# EAGLE design RPi_Extension_dac (EAGLE 8.4.3)
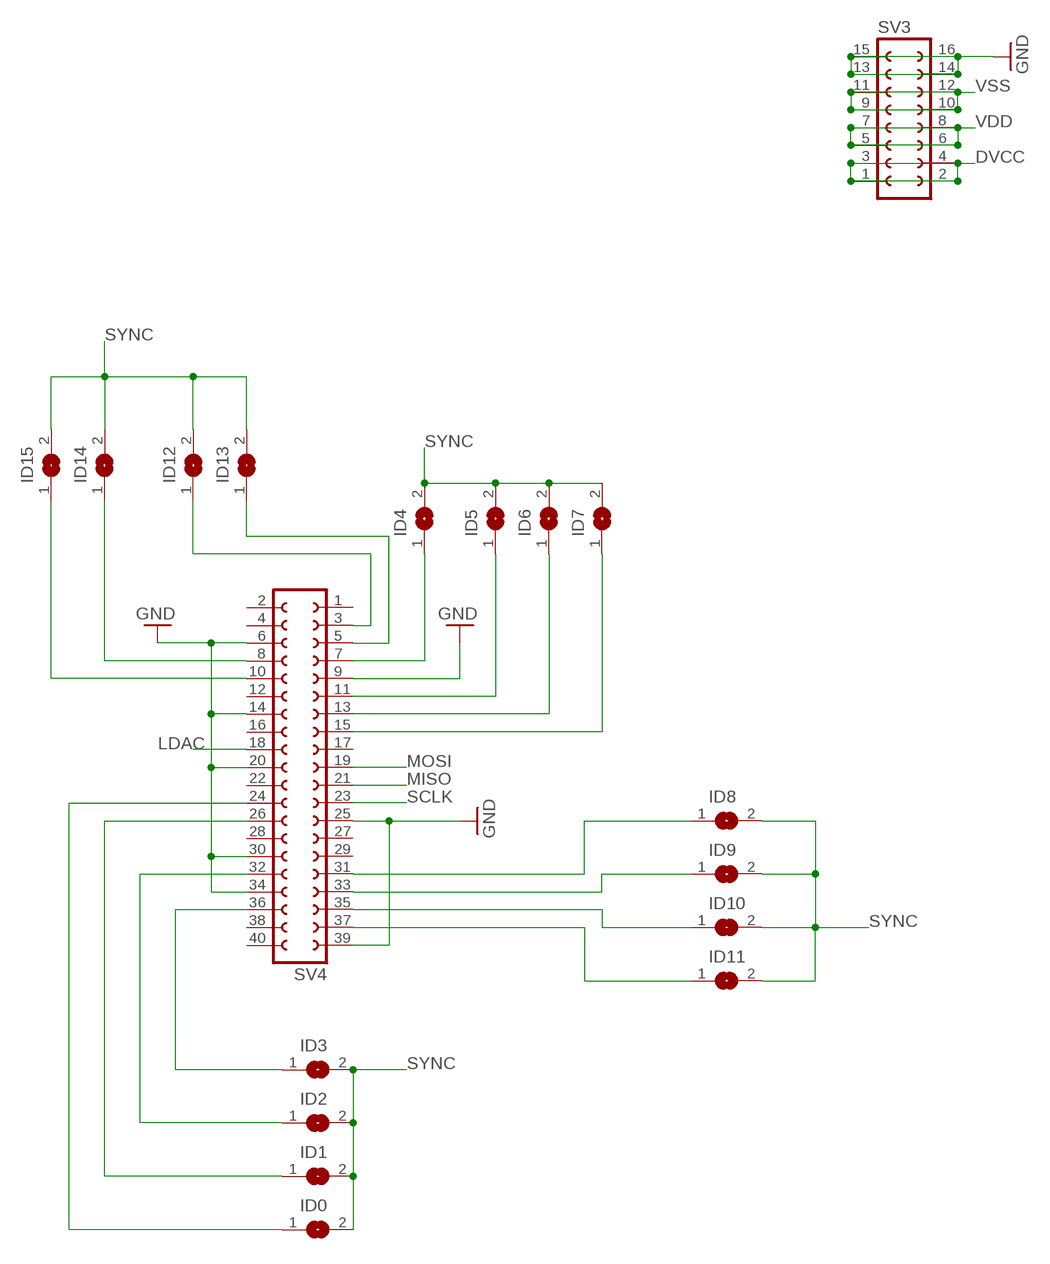
[diagram p0: schematic, sheet 1, part 1 of 2]
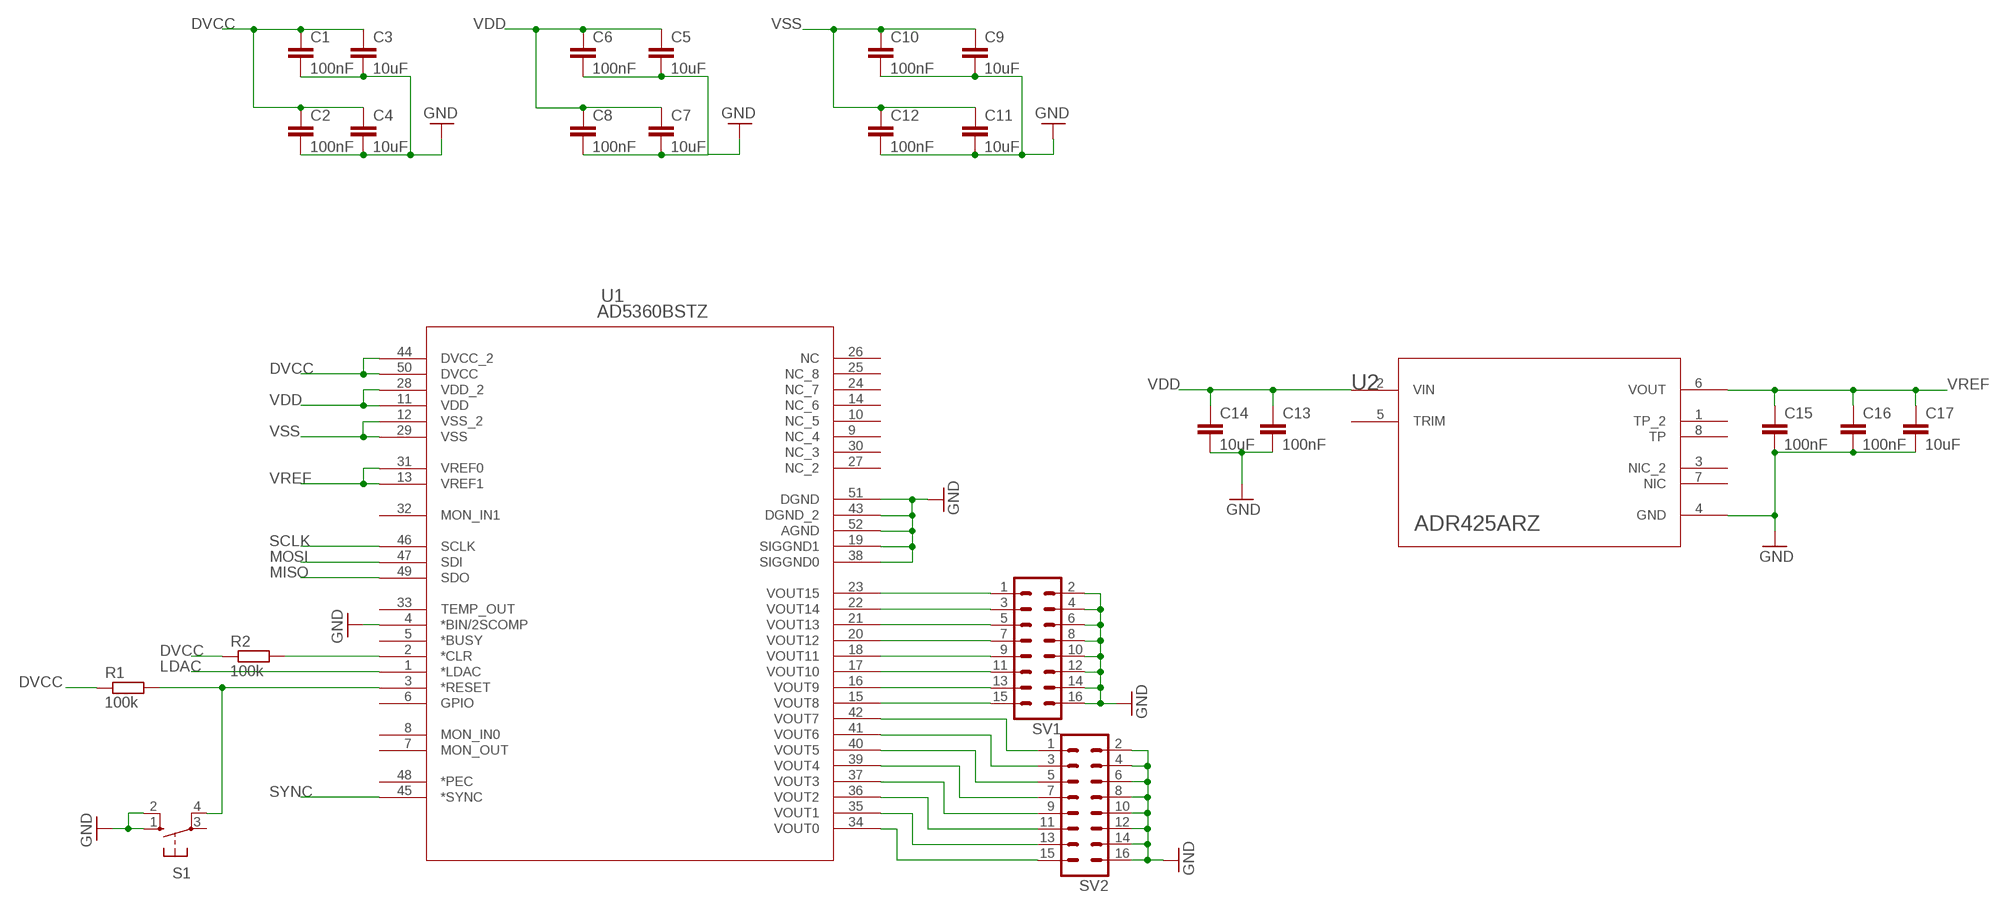
[diagram p1: schematic, sheet 1, part 2 of 2]

## Parts
C1  100nF  C-EUC0603  [C0603]
C2  100nF  C-EUC0603  [C0603]
C3  10uF  C-EUC1206  [C1206]
C4  10uF  C-EUC1206  [C1206]
C5  10uF  C-EUC1206  [C1206]
C6  100nF  C-EUC0603  [C0603]
C7  10uF  C-EUC1206  [C1206]
C8  100nF  C-EUC0603  [C0603]
C9  10uF  C-EUC1206  [C1206]
C10  100nF  C-EUC0603  [C0603]
C11  10uF  C-EUC1206  [C1206]
C12  100nF  C-EUC0603  [C0603]
C13  100nF  C-EUC0603  [C0603]
C14  10uF  C-EUC1206  [C1206]
C15  100nF  C-EUC0603  [C0603]
C16  100nF  C-EUC0603  [C0603]
C17  10uF  C-EUC1206  [C1206]
ID0  SJ  [SJ]
ID1  SJ  [SJ]
ID2  SJ  [SJ]
ID3  SJ  [SJ]
ID4  SJ  [SJ]
ID5  SJ  [SJ]
ID6  SJ  [SJ]
ID7  SJ  [SJ]
ID8  SJ  [SJ]
ID9  SJ  [SJ]
ID10  SJ  [SJ]
ID11  SJ  [SJ]
ID12  SJ  [SJ]
ID13  SJ  [SJ]
ID14  SJ  [SJ]
ID15  SJ  [SJ]
R1  100k  R-EU_R0603  [R0603]
R2  100k  R-EU_R0603  [R0603]
S1  10-XX  [B3F-10XX]
SV1  MA08-2W  [MA08-2W]
SV2  MA08-2W  [MA08-2W]
SV3  FE08-2  [FE08-2]
SV4  FE20-2  [FE20-2]
U1  AD5360BSTZ  [ST_52]
U2  ADR425ARZ  ADR423ARZ  [R_8]

## Nets
DVCC: C1.1 C2.1 C3.1 C4.1 R1.1 R2.1 SV3.1 SV3.2 SV3.3 SV3.4 U1.44(DVCC_2) U1.50(DVCC)
GND: C1.2 C2.2 C3.2 C4.2 C5.2 C6.2 C7.2 C8.2 C9.2 C10.2 C11.2 C12.2 C13.2 C14.2 C15.2 C16.2 C17.2 S1.1(S) S1.2(S1) SV1.2 SV1.4 SV1.6 SV1.8 SV1.10 SV1.12 SV1.14 SV1.16 SV2.2 SV2.4 SV2.6 SV2.8 SV2.10 SV2.12 SV2.14 SV2.16 SV3.13 SV3.14 SV3.15 SV3.16 SV4.6 SV4.9 SV4.14 SV4.20 SV4.25 SV4.30 SV4.34 SV4.39 U1.4(*BIN/2SCOMP) U1.19(SIGGND1) U1.38(SIGGND0) U1.43(DGND_2) U1.51(DGND) U1.52(AGND) U2.4(GND)
LDAC: SV4.18 U1.1(*LDAC)
MISO: SV4.21 U1.49(SDO)
MOSI: SV4.19 U1.47(SDI)
N$1: R2.2 U1.2(*CLR)
N$2: SV1.1 U1.23(VOUT15)
N$3: SV1.3 U1.22(VOUT14)
N$4: SV1.5 U1.21(VOUT13)
N$5: SV1.7 U1.20(VOUT12)
N$6: SV1.9 U1.18(VOUT11)
N$7: SV1.11 U1.17(VOUT10)
N$8: SV1.13 U1.16(VOUT9)
N$9: SV1.15 U1.15(VOUT8)
N$10: SV2.1 U1.42(VOUT7)
N$11: SV2.3 U1.41(VOUT6)
N$12: SV2.5 U1.40(VOUT5)
N$13: SV2.7 U1.39(VOUT4)
N$14: SV2.9 U1.37(VOUT3)
N$15: SV2.11 U1.36(VOUT2)
N$16: SV2.13 U1.35(VOUT1)
N$17: SV2.15 U1.34(VOUT0)
N$18: R1.2 S1.4(P1) U1.3(*RESET)
N$19: ID8.1 SV4.31
N$20: ID3.1 SV4.36
N$21: ID4.1 SV4.7
N$22: ID2.1 SV4.32
N$23: ID1.1 SV4.26
N$24: ID0.1 SV4.24
N$25: ID5.1 SV4.11
N$26: ID6.1 SV4.13
N$27: ID7.1 SV4.15
N$28: ID9.1 SV4.33
N$29: ID10.1 SV4.35
N$30: ID11.1 SV4.37
N$31: ID12.1 SV4.3
N$32: ID13.1 SV4.5
N$33: ID14.1 SV4.8
N$34: ID15.1 SV4.10
SCLK: SV4.23 U1.46(SCLK)
SYNC: ID0.2 ID1.2 ID2.2 ID3.2 ID4.2 ID5.2 ID6.2 ID7.2 ID8.2 ID9.2 ID10.2 ID11.2 ID12.2 ID13.2 ID14.2 ID15.2 U1.45(*SYNC)
VDD: C5.1 C6.1 C7.1 C8.1 C13.1 C14.1 SV3.5 SV3.6 SV3.7 SV3.8 U1.11(VDD) U1.28(VDD_2) U2.2(VIN)
VREF: C15.1 C16.1 C17.1 U1.13(VREF1) U1.31(VREF0) U2.6(VOUT)
VSS: C9.1 C10.1 C11.1 C12.1 SV3.9 SV3.10 SV3.11 SV3.12 U1.12(VSS_2) U1.29(VSS)
Unconnected: S1.3(P) SV4.1 SV4.2 SV4.4 SV4.12 SV4.16 SV4.17 SV4.22 SV4.27 SV4.28 SV4.29 SV4.38 SV4.40 U1.5(*BUSY) U1.6(GPIO) U1.7(MON_OUT) U1.8(MON_IN0) U1.9(NC_4) U1.10(NC_5) U1.14(NC_6) U1.24(NC_7) U1.25(NC_8) U1.26(NC) U1.27(NC_2) U1.30(NC_3) U1.32(MON_IN1) U1.33(TEMP_OUT) U1.48(*PEC) U2.1(TP_2) U2.3(NIC_2) U2.5(TRIM) U2.7(NIC) U2.8(TP)

## Library data of the parts
C1-C17 = rcl:C-EU: CAPACITOR, European symbol
ID0 ID1-ID15 = jumper:SJ: SMD solder JUMPER
R1 R2 = resistor:R-EU_: RESISTOR, European symbol
S1 = switch-omron:10-XX: OMRON SWITCH; MPN: B3F-1000; OC_FARNELL: 176432; OC_NEWARK: 36M3542
SV1 SV2 = con-lstb:MA08-2W: PIN HEADER; OC_FARNELL: unknown; OC_NEWARK: unknown
SV3 = con-lsta:FE08-2: FEMALE HEADER; OC_FARNELL: unknown; OC_NEWARK: unknown
SV4 = con-lsta:FE20-2: FEMALE HEADER; OC_FARNELL: unknown; OC_NEWARK: unknown
U1 = AD5360BSTZ:AD5360BSTZ
U2 = ADR423ARZ:ADR423ARZ; MANUFACTURER_PART_NUMBER: ADR423ARZ; VENDOR: Vendor

## Board
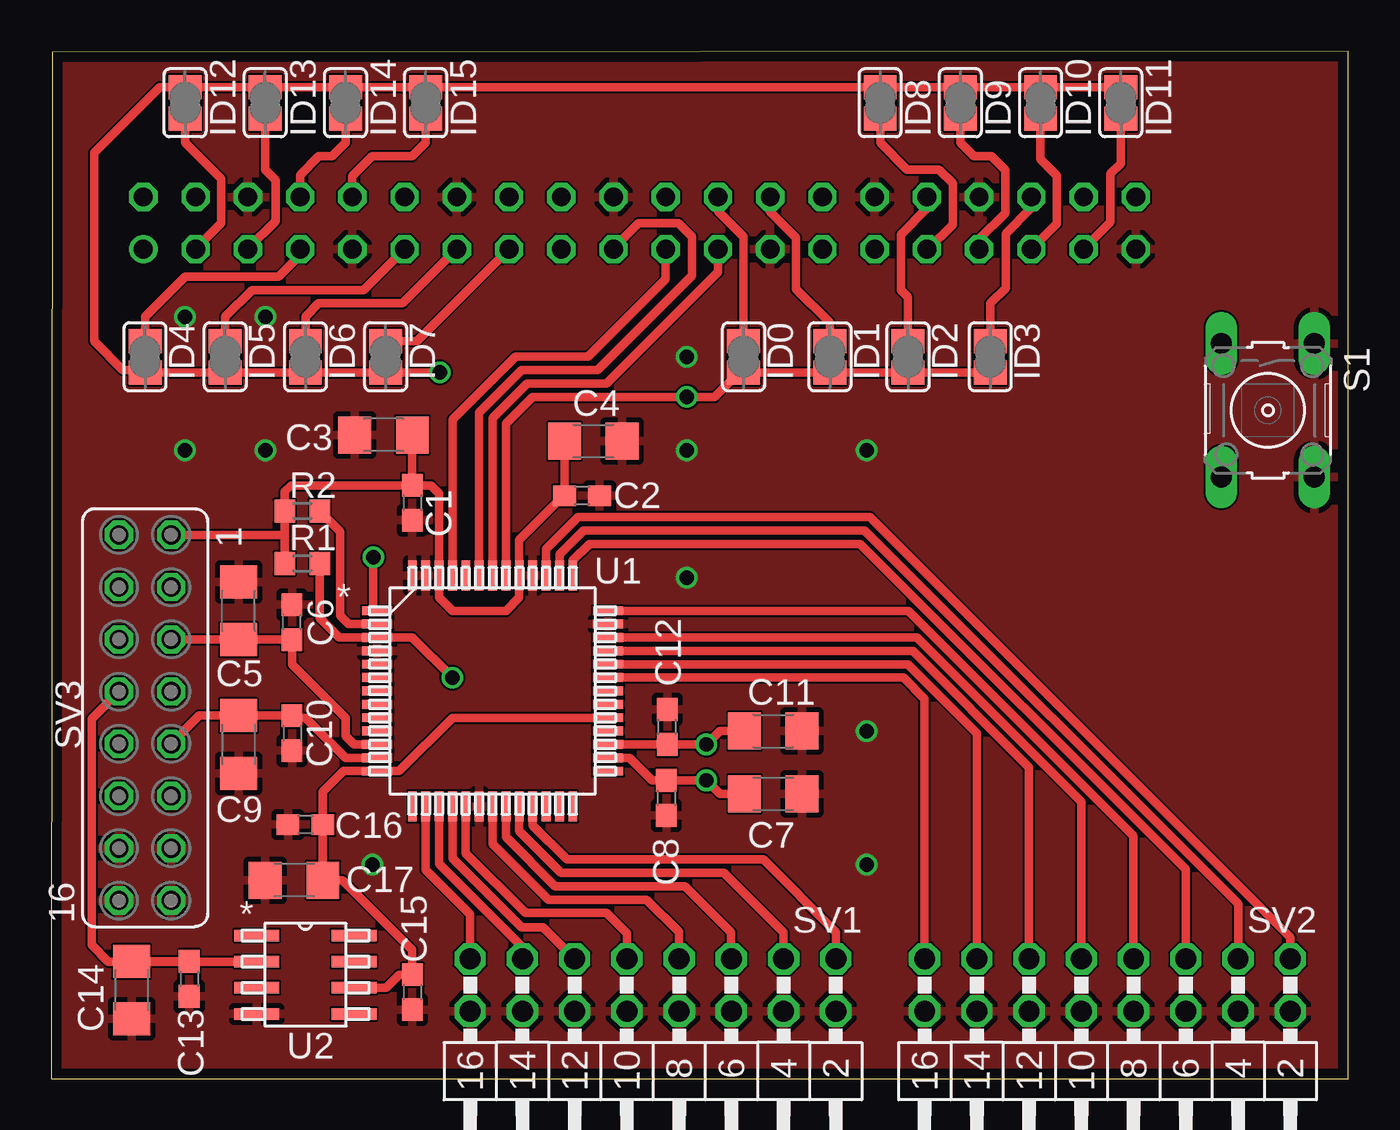
[diagram p2: board, top side]
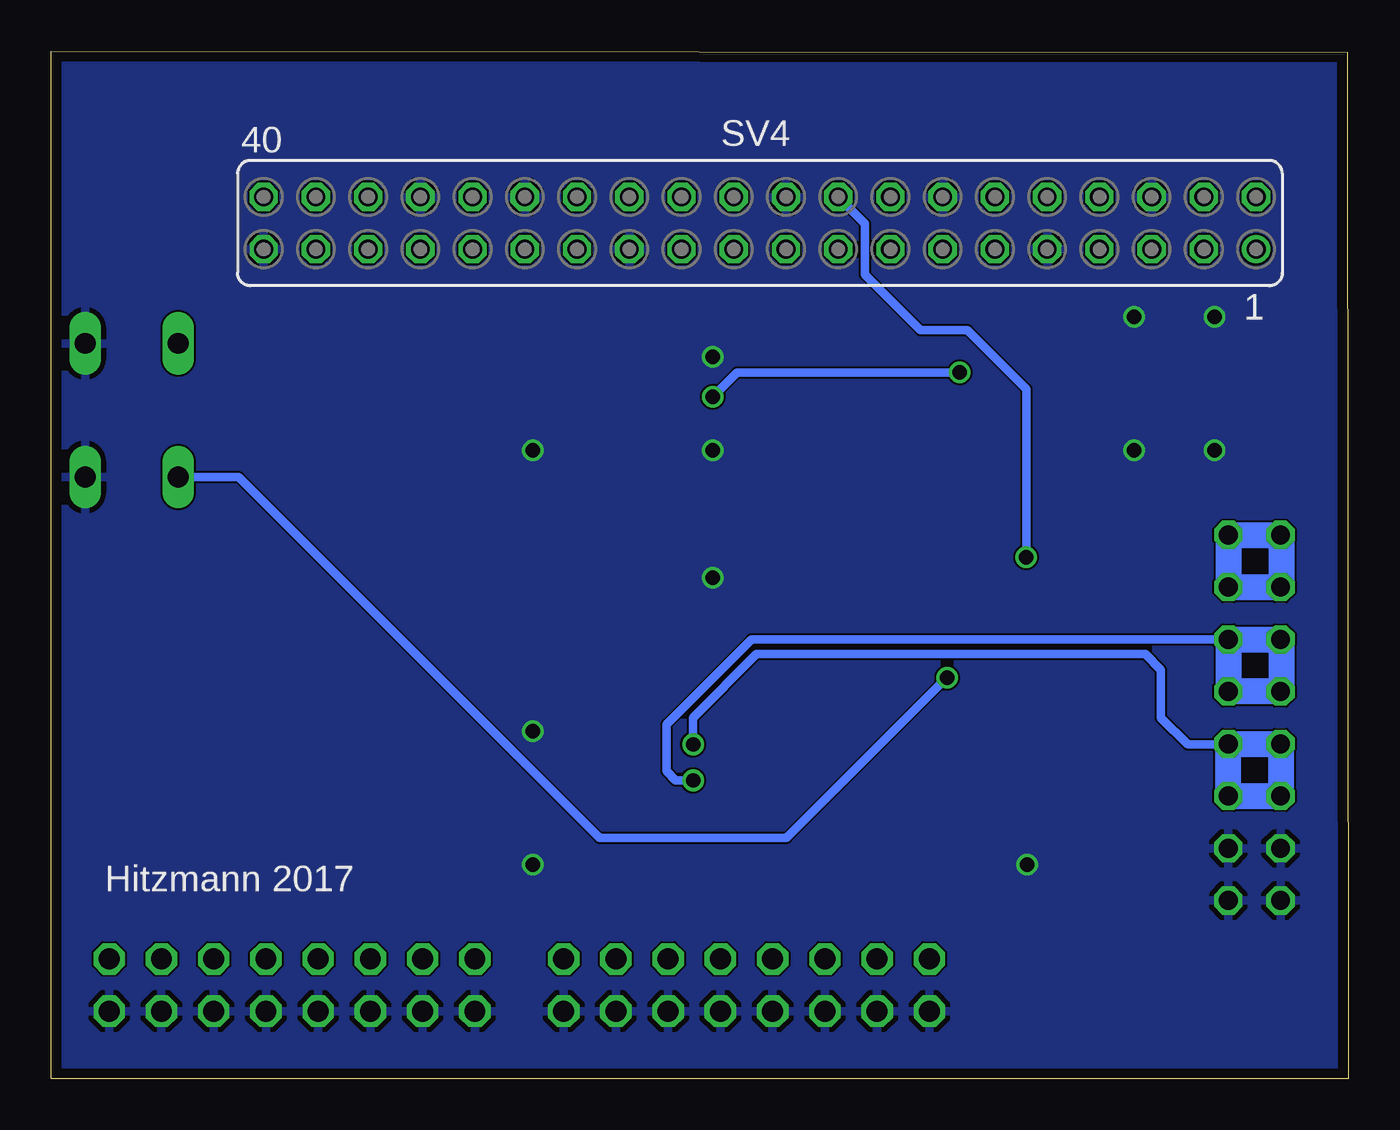
[diagram p3: board, bottom side, seen from below]

Size 63.05 x 49.95 mm. Coordinates in mm from the lower left corner, seen from the top.
Outline: 0,0 63.05,0 63.05,49.95 0.05,49.9 0,0
Copper layers (1*16): Top 0.035mm / dielectric 1.53mm / Bottom 0.035mm
Design rules "pban_4mil-l2": minimum track width 0.1mm, minimum drill 0.3mm, track to track 0.1mm, track to pad 0.229mm, pad to pad 0.1mm, via to via 0.1mm, smd to smd 0.1mm, copper to edge 0.5mm, drill to drill 0.5mm, minimum pad ring 0.15mm, minimum via ring 0.15mm, stop-mask expansion 4mil, vias tented up to drill 0.35mm, thermal gap 10mil

### Footprints (pad centres in the part's own frame; a part is rotated, then mirrored left to right if it is on the bottom)
C0603 = smd 1.1 x 1: 1 -0.85,0; 2 0.85,0
C1206 = smd 1.6 x 1.8: 1 -1.4,0; 2 1.4,0
SJ = smd 1.168 x 1.6: 1 -0.762,0; 2 0.762,0
R0603 = smd 1 x 1.1: 1 -0.85,0; 2 0.85,0
B3F-10XX = drill 1.016 long: 1 -3.251,2.261; 2 3.251,2.261; 3 -3.251,-2.261; 4 3.251,-2.261
MA08-2W = drill 1.016 octagon: 1 -8.89,-1.27; 2 -8.89,1.27; 3 -6.35,-1.27; 4 -6.35,1.27; 5 -3.81,-1.27; 6 -3.81,1.27; 7 -1.27,-1.27; 8 -1.27,1.27; 9 1.27,-1.27; 10 1.27,1.27; 11 3.81,-1.27; 12 3.81,1.27; 13 6.35,-1.27; 14 6.35,1.27; 15 8.89,-1.27; 16 8.89,1.27
FE08-2 = drill 0.914 octagon: 1 -8.89,1.27; 2 -8.89,-1.27; 3 -6.35,1.27; 4 -6.35,-1.27; 5 -3.81,1.27; 6 -3.81,-1.27; 7 -1.27,1.27; 8 -1.27,-1.27; 9 1.27,1.27; 10 1.27,-1.27; 11 3.81,1.27; 12 3.81,-1.27; 13 6.35,1.27; 14 6.35,-1.27; 15 8.89,1.27; 16 8.89,-1.27
FE20-2 = drill 0.914: 1 -24.13,1.27 | drill 0.914 octagon: 2 -24.13,-1.27; 3 -21.59,1.27; 4 -21.59,-1.27; 5 -19.05,1.27; 6 -19.05,-1.27; 7 -16.51,1.27; 8 -16.51,-1.27; 9 -13.97,1.27; 10 -13.97,-1.27; 11 -11.43,1.27; 12 -11.43,-1.27; 13 -8.89,1.27; 14 -8.89,-1.27; 15 -6.35,1.27; 16 -6.35,-1.27; 17 -3.81,1.27; 18 -3.81,-1.27; 19 -1.27,1.27; 20 -1.27,-1.27; 21 1.27,1.27; 22 1.27,-1.27; 23 3.81,1.27; 24 3.81,-1.27; 25 6.35,1.27; 26 6.35,-1.27; 27 8.89,1.27; 28 8.89,-1.27; 29 11.43,1.27; 30 11.43,-1.27; 31 13.97,1.27; 32 13.97,-1.27; 33 16.51,1.27; 34 16.51,-1.27; 35 19.05,1.27; 36 19.05,-1.27; 37 21.59,1.27; 38 21.59,-1.27; 39 24.13,1.27; 40 24.13,-1.27
ST_52 = smd 1.473 x 0.432: 1 -5.613,3.9; 2 -5.613,3.25; 3 -5.613,2.6; 4 -5.613,1.95; 5 -5.613,1.3; 6 -5.613,0.65; 7 -5.613,0; 8 -5.613,-0.65; 9 -5.613,-1.3; 10 -5.613,-1.95; 11 -5.613,-2.6; 12 -5.613,-3.25; 13 -5.613,-3.9; 27 5.613,-3.9; 28 5.613,-3.25; 29 5.613,-2.6; 30 5.613,-1.95; 31 5.613,-1.3; 32 5.613,-0.65; 33 5.613,0; 34 5.613,0.65; 35 5.613,1.3; 36 5.613,1.95; 37 5.613,2.6; 38 5.613,3.25; 39 5.613,3.9 | smd 0.432 x 1.473: 14 -3.9,-5.613; 15 -3.25,-5.613; 16 -2.6,-5.613; 17 -1.95,-5.613; 18 -1.3,-5.613; 19 -0.65,-5.613; 20 0,-5.613; 21 0.65,-5.613; 22 1.3,-5.613; 23 1.95,-5.613; 24 2.6,-5.613; 25 3.25,-5.613; 26 3.9,-5.613; 40 3.9,5.613; 41 3.25,5.613; 42 2.6,5.613; 43 1.95,5.613; 44 1.3,5.613; 45 0.65,5.613; 46 0,5.613; 47 -0.65,5.613; 48 -1.3,5.613; 49 -1.95,5.613; 50 -2.6,5.613; 51 -3.25,5.613; 52 -3.9,5.613
R_8 = smd 2.184 x 0.559: 1 -2.362,1.905; 2 -2.362,0.635; 3 -2.362,-0.635; 4 -2.362,-1.905; 5 2.362,-1.905; 6 2.362,-0.635; 7 2.362,0.635; 8 2.362,1.905

### Placement (x,y rotation side)
C1  17.55,28 270 top
C2  25.8,28.35 0 top
C3  16.15,31.3 180 top
C4  26.35,31 0 top
C5  9.1,22.75 90 top
C6  11.7,22.2 90 top
C7  35.1,13.85 0 top
C8  29.9,13.65 270 top
C9  9.1,16.25 270 top
C10  11.7,16.8 270 top
C11  35.1,16.9 0 top
C12  29.95,17.1 90 top
C13  6.7,4.85 270 top
C14  3.9,4.3 270 top
C15  17.55,4.2 270 top
C16  12.35,12.35 180 top
C17  11.8,9.65 180 top
ID0  33.65,35.1 270 top
ID1  37.85,35.1 270 top
ID2  41.65,35.1 270 top
ID3  45.65,35.1 270 top
ID4  4.55,35.1 270 top
ID5  8.45,35.1 270 top
ID6  12.35,35.1 270 top
ID7  16.25,35.1 270 top
ID8  40.3,47.45 90 top
ID9  44.2,47.45 90 top
ID10  48.1,47.45 90 top
ID11  52,47.45 90 top
ID12  6.5,47.45 90 top
ID13  10.4,47.45 90 top
ID14  14.3,47.45 90 top
ID15  18.2,47.45 90 top
R1  12.2,25.05 0 top
R2  12.2,27.6 0 top
S1  59.15,32.5 270 top
SV1  29.25,4.55 180 top
SV2  51.35,4.55 180 top
SV3  4.55,17.55 270 top
SV4  28.6,41.6 180 bottom
U1  21.45,18.85 0 top
U2  12.35,5.05 0 top

### Tracks (layer width: path | path; a pad name or v marks a point on that pad's centre or on a via)
DVCC
  Top 0.406: C4.1 C2.1 24.9,28.35 22.75,26.2 U1.44 | C3.1 C1.1 | U1.44 22.75,23.4 22.1,22.75 19.5,22.75 18.85,23.4 U1.50 18.85,28.45 18.45,28.85 C1.1 | U1.44 22.75,25.35 | C1.1 17.7,28.55 | C1.1 11.65,28.85 11.35,28.55 R2.1 11.35,26.4 | SV3.1 11.31,26.44 11.35,26.4 | 11.35,26.4 R1.1
  Bottom 0.406: SV3.2 SV3.1
  Bottom 1.27: SV3.4 SV3.3 SV3.1 3.25,26.44 3.25,24.05
GND  (via drill 0.7)
  other vias: 30.9,35.1 6.5,37.05 10.4,37.05 6.5,30.55 10.4,30.55 39.65,30.55 39.65,16.9 39.65,10.4 15.6,10.4 30.9,30.55 30.9,24.35
  pour Top: -0.65,-0.65 63.7,-0.65 63.7,50.7 -0.65,50.7
  pour Bottom: 0,0 0,50.05 63.05,50.05 63.05,0
LDAC  (via drill 0.7)
  Top 0.254: U1.1 15.6,22.75
  Top 0.305: 15.6,22.75 15.65,22.85
  Top 0.406: 15.65,22.85 v15.65,25.35
  Bottom 0.406: v15.65,25.35 15.65,33.54 18.51,36.4 20.8,36.4 23.5,39.1 23.5,41.58 SV4.18
MISO
  Top 0.406: SV4.21 29.87,38.87 26.1,35.1 22.56,35.1 19.5,32.04 U1.49
MOSI
  Top 0.406: SV4.19 27.33,40.39 28.54,41.6 30.49,41.6 31.15,40.94 31.15,39.05 26.55,34.45 22.85,34.45 20.8,32.4 U1.47
N$1
  Top 0.406: R2.2 14.05,26.6 14.05,22.51 14.46,22.1 U1.2
N$2
  Top 0.406: U1.23 23.4,12.32 25.07,10.65 34.62,10.65 38.15,7.12 SV1.1
N$3
  Top 0.406: U1.22 22.75,12.04 24.79,10 32.7,10 35.6,7.1 SV1.3
N$4
  Top 0.406: U1.21 22.1,11.74 24.49,9.35 30.8,9.35 33.05,7.1 SV1.5
N$5
  Top 0.406: U1.20 21.45,11.42 24.17,8.7 28.95,8.7 30.52,7.12 SV1.7
N$6
  Top 0.406: SV1.9 27.98,7.07 27,8.05 23.05,8.05 20.15,10.95 U1.18
N$7
  Top 0.406: U1.17 19.5,10.7 22.85,7.35 23.91,7.35 SV1.11
N$8
  Top 0.406: U1.16 18.85,10.43 22.9,6.38 SV1.13
N$9
  Top 0.406: SV1.15 20.36,7.99 18.2,10.15 U1.15
N$10
  Top 0.406: SV2.1 60.24,6.86 39.8,27.3 25.61,27.3 24.05,25.74 U1.42
N$11
  Top 0.406: U1.41 24.7,25.48 25.87,26.65 39.54,26.65 57.7,8.49 SV2.3
N$12
  Top 0.406: U1.40 25.35,25.19 26.16,26 39.32,26 55.15,10.17 SV2.5
N$13
  Top 0.406: SV2.7 52.62,11.81 41.68,22.75 U1.39
N$14
  Top 0.406: SV2.9 50.08,13.47 42.1,21.45 U1.37
N$15
  Top 0.406: SV2.11 47.54,15.14 41.88,20.8 U1.36
N$16
  Top 0.406: SV2.13 45,16.79 41.64,20.15 U1.35
N$17
  Top 0.406: SV2.15 42.46,18.46 41.42,19.5 U1.34
N$18  (via drill 0.7)
  Top 0.406: 14.85,21.45 U1.3 | R1.2 13.05,22.39 13.99,21.45 U1.3 | U1.3 17.55,21.45 v19.5,19.5
  Bottom 0.406: S1.4 53.95,29.25 36.4,11.7 27.3,11.7 v19.5,19.5
N$19
  Top 0.406: SV4.31 42.63,40.33 43.83,41.53 43.83,43.53 43.16,44.2 41.6,44.2 40.3,45.5 ID8.1
N$20
  Top 0.406: SV4.36 47.65,42.35 46.4,41.1 46.4,38.45 45.65,37.7 ID3.1
N$21
  Top 0.406: SV4.7 12.09,40.04 11.05,39 6.5,39 4.55,37.05 ID4.1
N$22
  Top 0.406: SV4.32 42.57,42.32 41.3,41.05 41.3,38.35 41.65,38 ID2.1 41.75,36.25
N$23
  Top 0.406: SV4.26 34.95,42.15 36.2,40.9 36.2,38.4 37.85,36.75 ID1.1
N$24
  Top 0.406: SV4.24 32.41,42.19 33.65,40.95 ID0.1
N$25
  Top 0.406: ID5.1 8.45,37.05 9.75,38.35 15.19,38.35 SV4.11
N$26
  Top 0.406: ID6.1 12.35,37.05 13,37.7 17.08,37.7 SV4.13
N$27
  Top 0.406: ID7.1 17.78,35.86 SV4.15
N$28
  Top 0.406: ID9.1 44.2,45.5 44.85,44.85 45.7,44.85 46.38,44.17 46.38,42.08 45.11,40.81 SV4.33
N$29
  Top 0.406: ID10.1 48.1,44.7 48.9,43.9 48.9,41.58 SV4.35
N$30
  Top 0.406: ID11.1 52,44.5 51.5,44 51.5,41.64 SV4.37
N$31
  Top 0.406: SV4.3 7.01,40.36 8.25,41.6 8.25,43.75 6.5,45.5 ID12.1
N$32
  Top 0.406: SV4.5 9.55,40.35 10.9,41.7 10.9,43.7 10.4,44.2 ID13.1
N$33
  Top 0.406: SV4.8 12.09,43.94 13,44.85 13.65,44.85 14.3,45.5 ID14.1
N$34
  Top 0.406: SV4.10 14.63,43.88 15.6,44.85 17.55,44.85 18.2,45.5 ID15.1
SCLK
  Top 0.406: 31.45,38.24 31.44,38.24 | 31.44,38.24 27,33.8 23.14,33.8 21.45,32.11 U1.46 | 31.44,38.24 32.41,39.21 SV4.23
SYNC  (via drill 0.7)
  Top 0.406: ID3.2 ID2.2 ID1.2 ID0.2 33.44,34.34 32.25,33.15 v30.9,33.15 23.4,33.15 22.1,31.85 U1.45 | v18.9,34.35 v18.89,34.34 ID7.2 ID6.2 ID5.2 ID4.2 4.44,34.45 3.48,34.45 2.08,35.85 2.08,45.02 5.27,48.21 ID12.2 ID13.2 ID14.2 ID15.2 ID8.2 ID9.2 ID11.2 ID10.2
  Bottom 0.406: v18.89,34.34 29.71,34.34 v30.9,33.15
VDD  (via drill 0.7)
  Top 0.406: SV3.5 C5.1 C6.1 11.7,20.15 14.3,17.55 14.3,16.67 14.72,16.25 U1.11 | U1.28 28.1,15.6 29.2,14.5 C8.1 v31.85,14.5 32.5,13.85 C7.1 | C14.1 C13.1 6.71,5.68 U2.2 2.77,5.68 1.95,6.5 1.95,17.49 SV3.8
  Bottom 0.406: SV3.6 SV3.5 29.02,21.35 33.15,17.22 33.15,14.95 32.7,14.5 v31.85,14.5
  Bottom 1.27: SV3.8 SV3.7 SV3.5 3.25,21.36 3.25,18.85
VREF
  Top 0.406: U1.31 19.5,17.55 16.9,14.95 U1.13 14.2,14.95 13.2,13.95 C16.1 C17.1 14.15,9.65 17.55,6.25 C15.1 16.9,5.05 16.27,4.42 U2.6
VSS  (via drill 0.7)
  Top 0.406: v31.85,16.25 C12.1 U1.29 v31.85,16.25 | 5.82,16.3 SV3.9 7.19,17.65 C9.1 C10.1 11.8,17.55 12.35,17.55 14.3,15.6 U1.12 | C11.1 32.5,16.9 v31.85,16.25
  Bottom 0.406: 5.85,16.28 SV3.9 5.85,16.25 7.8,16.25 9.1,17.55 9.1,19.88 9.86,20.64 28.76,20.64 31.85,17.55 v31.85,16.25 31.85,17.28 | 5.82,13.65 SV3.11
  Bottom 1.27: SV3.9 SV3.10 SV3.12 SV3.11 | 5.85,16.28 5.85,13.75

### Text on the board
bNames: Hitzmann 2017